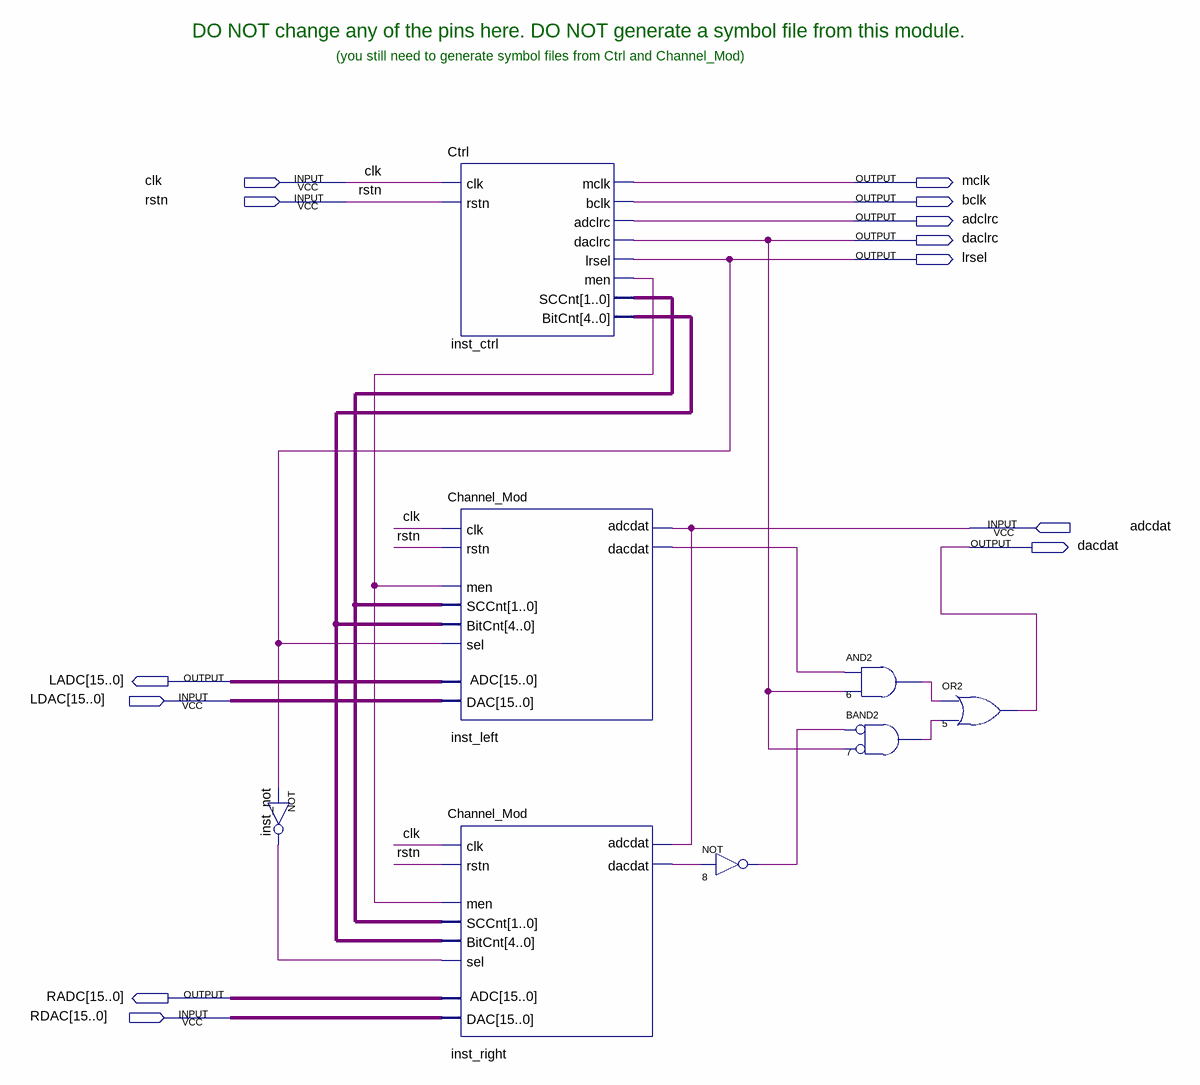
[diagram p0: schematic sheet]
// Quartus schematic SndDriver.bdf as structural Verilog: 8 symbols, 13 pins
module SndDriver (
  input  clk,
  input  rstn,
  input  adcdat,
  input  [15:0] LDAC,
  input  [15:0] RDAC,
  output mclk,
  output bclk,
  output adclrc,
  output daclrc,
  output lrsel,
  output dacdat,
  output [15:0] LADC,
  output [15:0] RADC
);

  wire inst_ctrl_men, inst_left_dacdat, inst_not_out, inst_right_dacdat, n6_out, n7_out, n8_out;
  wire [1:0] inst_ctrl_sccnt;
  wire [4:0] inst_ctrl_bitcnt;

  not inst_not (inst_not_out, lrsel);
  Ctrl inst_ctrl (
    .clk(clk), .rstn(rstn), .mclk(mclk), .bclk(bclk), .adclrc(adclrc), .daclrc(daclrc), .men(inst_ctrl_men),
    .lrsel(lrsel), .SCCnt(inst_ctrl_sccnt), .BitCnt(inst_ctrl_bitcnt));
  Channel_Mod inst_left (
    .clk(clk), .rstn(rstn), .men(inst_ctrl_men), .sel(lrsel), .SCCnt(inst_ctrl_sccnt),
    .BitCnt(inst_ctrl_bitcnt), .adcdat(adcdat), .DAC(LDAC), .dacdat(inst_left_dacdat), .ADC(LADC));
  Channel_Mod inst_right (
    .clk(clk), .rstn(rstn), .men(inst_ctrl_men), .sel(inst_not_out), .SCCnt(inst_ctrl_sccnt),
    .BitCnt(inst_ctrl_bitcnt), .adcdat(adcdat), .DAC(RDAC), .dacdat(inst_right_dacdat), .ADC(RADC));
  not u_8 (n8_out, inst_right_dacdat);
  and u_6 (n6_out, inst_left_dacdat, daclrc);
  and u_7 (n7_out, ~n8_out, ~daclrc);  // BAND2
  or u_5 (dacdat, n6_out, n7_out);

  // Notes on the sheet:
  //   DO NOT change any of the pins here. DO NOT generate a symbol file from this module.
  //   (you still need to generate symbol files from Ctrl and Channel_Mod)
endmodule
